# EAGLE design TSL2561 Stemma (EAGLE 6.6.0)
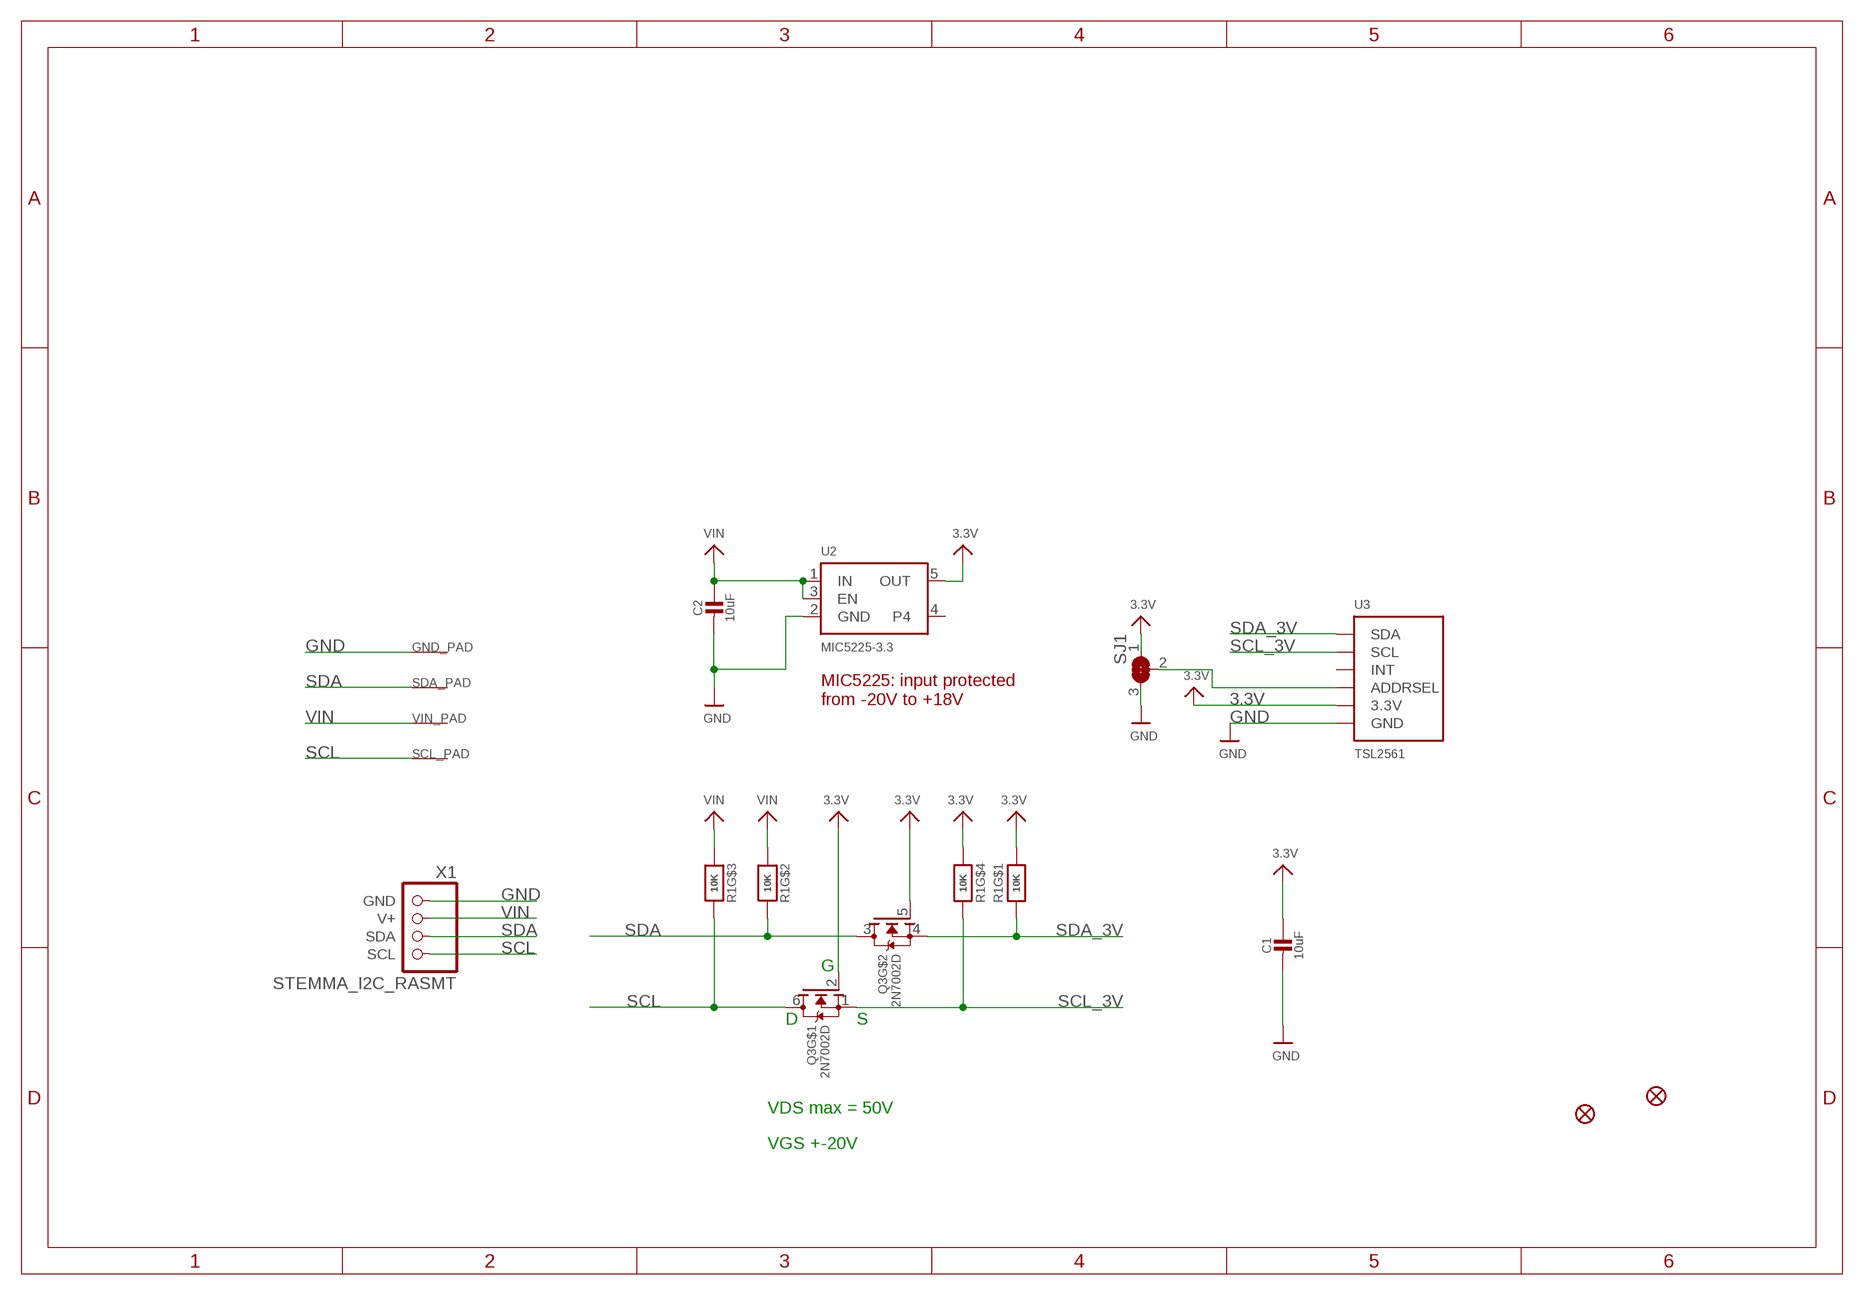
[diagram p0: schematic, sheet 1]

## Parts
C1  10uF  CAP_CERAMIC0805-NOOUTLINE  [0805-NO]
C2  10uF  CAP_CERAMIC0805-NOOUTLINE  [0805-NO]
FID1  FIDUCIAL_1MM  [FIDUCIAL_1MM]
FID2  FIDUCIAL_1MM  [FIDUCIAL_1MM]
GND_PAD  SEWTAP-ALLIGATOR  [SEWALLI]
Q3  2N7002D  MOSFET-N_DUAL  [SOT363]
R1  10K  RESISTOR_4PACK  [RESPACK_4X0603]
SCL_PAD  SEWTAP-ALLIGATOR  [SEWALLI]
SDA_PAD  SEWTAP-ALLIGATOR  [SEWALLI]
SJ1  SOLDERJUMPER_2WAY  [SOLDERJUMPER_2WAY_OPEN_NOPASTE]
U2  MIC5225-3.3  VREG_SOT23-5  [SOT23-5]
U3  TSL2561  LIGHT_TSL2561  [TSL2561_FN]
VIN_PAD  SEWTAP-ALLIGATOR  [SEWALLI]
X1  STEMMA_I2C_RASMT  [JSTPH4]

## Nets
3.3V: C1.1 Q3.2(G) Q3.5(G) R1.1 R1.5 SJ1.1 U2.5(OUT) U3.VDD(3.3V)
GND: C1.2 C2.2 GND_PAD.P$1(SEW) SJ1.3 U2.2(GND) U3.VSS(GND) X1.1(GND)
N$1: SJ1.2 U3.ADR(ADDRSEL)
SCL: Q3.6(D) R1.6 SCL_PAD.P$1(SEW) X1.4(SCL)
SCL_3V: Q3.1(S) R1.4 U3.CLK(SCL)
SDA: Q3.3(D) R1.7 SDA_PAD.P$1(SEW) X1.3(SDA)
SDA_3V: Q3.4(S) R1.8 U3.DATA(SDA)
VIN: C2.1 R1.2 R1.3 U2.1(IN) U2.3(EN) VIN_PAD.P$1(SEW) X1.2(V+)
Unconnected: U2.4 U3.INT

## Notes on the sheet
- MIC5225: input protected
  from -20V to +18V
- G
- D | S
- VDS max = 50V
- VGS +-20V

## Library data of the parts
C1 C2 = microbuilder:CAP_CERAMIC: Ceramic Capacitors For new designs, use the packages preceded by an '_' character since they are more reliable: The following footprints should be used on most boards: _0402 - Standard footprint for regular board layouts _0603 - Standard footprint for regular board layouts _0805 - Standard footprint for regular board layouts _1206 - Standard footprint for regular board layouts For extremely tight-pitch boards where space is at a premium, the following 'micro-pitch' footprints can be used (smaller pads, no silkscreen outline, etc.): _0402MP - Micro-pitch footprint for very dense/compact boards _0603MP - Micro-pitch footprint for very dense/compact boards _0805MP - Micro-pitch footprint for very dense/compact boards _1206MP - Micro-pitch footprint for very dense/compact boards
FID1 FID2 = microbuilder:FIDUCIAL: Fiducial Alignment Points Various fiducial points for machine vision alignment.; BOM: EXCLUDE
GND_PAD SCL_PAD SDA_PAD VIN_PAD = microbuilder:SEWTAP
Q3 = microbuilder:MOSFET-N_DUAL: Dual N-Channel MOSFET SOT363 (2.0x1.25mm) 2N7002PS - 60V, 320mA [Digikey: 568-5984-1-ND]
R1 = microbuilder:RESISTOR_4PACK: Resistor Packs (4 resistors) 4 x 0603 10K 1/16W - Digikey: YC164J-10KCT-ND
SJ1 = microbuilder:SOLDERJUMPER_2WAY: 2-Way Solder Jumper
U2 = microbuilder:VREG_SOT23-5: SOT23-5 Fixed Voltage Regulators Part Current Out V Out V In V Dropout θJA (°C/W) TJ (°C) Digikey Part No. ADP121 150mA 3.3V 3.4-5.5V 0.09V @ 150mA -- -- ADP121-AUJZ33R7CT-ND ADP121 150mA 3.0V 3.1-5.5V 0.09V @ 150mA -- -- ADP121-AUJZ30R7CT-ND ADP122 300mA 3.3V 3.4-5.5V 0.085V @ 300mA -- -- ADP122AUJZ-3.3-R7CT-ND ADP1712 300mA 3.3V 3.5-5.5V 0.17V @ 300mA -- -- ADP1712AUJZ-3.3-R7TR-ND AP7311 (Low Cost) 150mA 3.3V 3.5-6V 0.15V @ 150mA -- -- AP7311-33WG-7DICT-ND LD39015M18R 150mA 1.8V 1.9V-5.5V 0.08V @ 100mA -- -- 497-6977-1-ND LP2985A-33DBVR 150mA 3.3V 3.3-16V 0.28V @ 150mA 206 150 296-18479-1-ND MCP1824T-3302E/OT 300mA 3.3V 3.5V-6V 0.2V @ 300mA -- -- MCP1824T-3302E/OTCT-ND MIC5205-2.5YM5 TR 150mA 2.5V 2.7-16V 0.165V @ 150mA -- -- 576-1257-2-ND MIC5205-3.0YM5 TR 150mA 3.0V 3.2V-16V 0.165V @ 150mA -- -- 576-1258-2-ND MIC5205-3.3YM5 TR 150mA 3.3V 3.5V-16V 0.165V @ 150mA -- -- 576-1259-2-ND TPS780330220 150mA 3.3V+2.2V 3.6-5.5V 250mV Max -- -- 296-23332-1-ND TDA3663/N1,135 100mA 3.3V 3.5-45V 0.18V @ 50mA -- -- 568-5343-1-ND Max operating temp can be calculated using θJA, TJ (max junction temperature), and power in watts. Set the "Maximum Ambient Temperature" until it reaches TJ ("Max Junction Temperature"), which is the absolute limit for safe use of the regulator: Heat Sink Temperature Calculator <http://www.daycounter.com/Calculators/Heat-Sink-Temperature-Calculator.phtml> For example, With 12V source into a 3.3V LP2985 and a 30mA load, we are dissipating (12V-3.3V) * 0.03A = 0.261W. With a θJA of 206 °C/W, a TJ of 150°C, and 261mW we can safely use the chip without a heat sink up to 75°C (=147.1°C Junction Temperature).
U3 = microbuilder:LIGHT_TSL2561: TSL2561 Light-To-Digital Sensor Mouser Part Numbers: CS (obsolete): 856-TSL2561CS DFN (cheapest): 856-TSL2561FN
X1 = microbuilder:STEMMA_I2C

## Net classes
1 GND: width 0.305 mm
2 VIN: width 0.305 mm
3 +3.3: width 0.305 mm

## Board
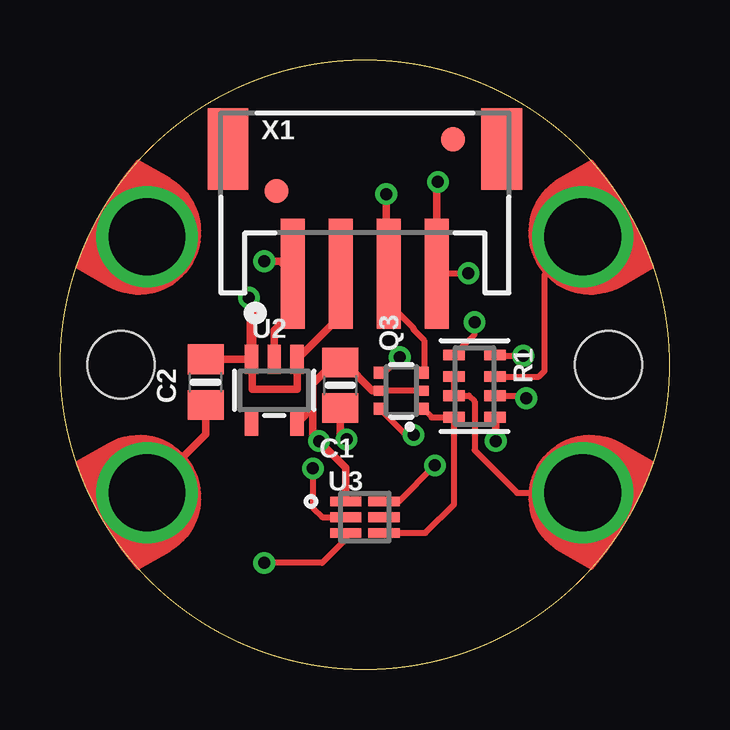
[diagram p1: board, top side]
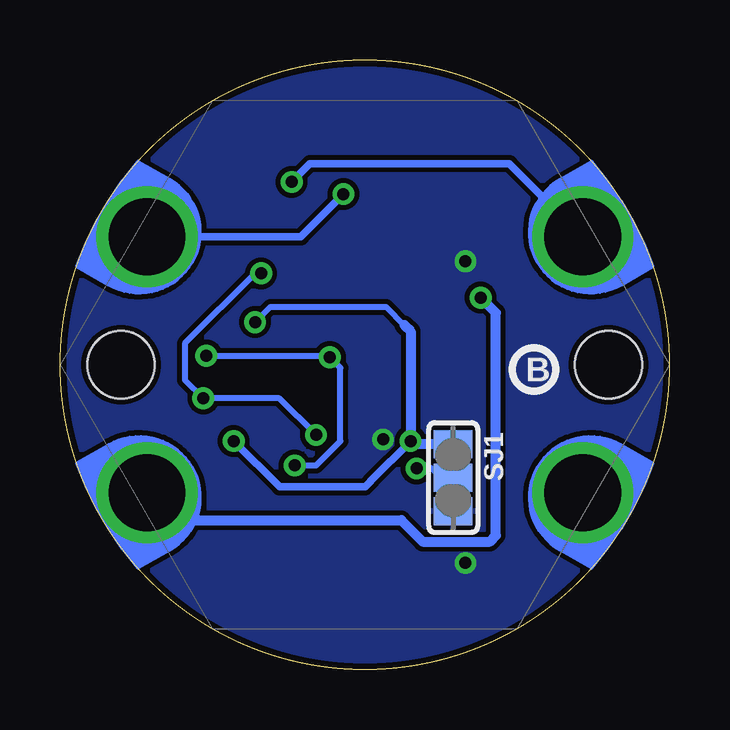
[diagram p2: board, bottom side, seen from below]

Size 25.4 x 25.4 mm. Coordinates in mm from the lower left corner, seen from the top.
Outline: circle at 12.7,12.7 radius 12.7
Copper layers (1*16): Top 0.035mm / dielectric 1.5mm / Bottom 0.035mm
Design rules "adafruit *": minimum track width 8mil, minimum drill 15.5mil, track to track 8mil, track to pad 8mil, pad to pad 8mil, via to via 8mil, smd to smd 8mil, copper to edge 10mil, drill to drill 8mil, minimum pad ring 10mil, minimum via ring 8mil, stop-mask expansion 4mil, vias tented up to drill 20mil, thermal gap 10mil
Holes 2.8 mm at 2.54,12.7 22.86,12.7

### Footprints (pad centres in the part's own frame; a part is rotated, then mirrored left to right if it is on the bottom)
0805-NO = smd 1.24 x 1.5: 1 -0.95,0; 2 0.95,0
FIDUCIAL_1MM = smd 1 x 1: 1 0,0
SEWALLI = drill 3.2: P$1 0,0.508
SOT363 = smd 0.5 x 0.5: 1 -0.75,-0.9; 3 0.75,-0.9; 4 0.75,0.9; 6 -0.75,0.9 | smd 0.4 x 0.5: 2 0,-0.9; 5 0,0.9
RESPACK_4X0603 = smd 0.45 x 0.9: 1 -1.3,-0.85; 2 -0.4,-0.85; 3 0.4,-0.85; 4 1.3,-0.85; 5 1.3,0.85; 6 0.4,0.85; 7 -0.4,0.85; 8 -1.3,0.85
SOLDERJUMPER_2WAY_OPEN_NOPASTE = smd 1.168 x 1.6: 1 -1.397,0; 2 0,0; 3 1.397,0
SOT23-5 = smd 0.55 x 1.2: 1 -0.95,-1.3; 2 0,-1.3; 3 0.95,-1.3; 4 0.95,1.3; 5 -0.95,1.3
TSL2561_FN = smd 1.3 x 0.4: ADR -0.8,0; CLK 0.8,-0.65; DATA 0.8,0.65; INT 0.8,0; VDD -0.8,0.65; VSS -0.8,-0.65
JSTPH4 = smd 1 x 4.6: 1 -3,-3.7; 2 -1,-3.7; 3 1,-3.7; 4 3,-3.7 | smd 1.7 x 3.4: NC1 -5.7,1.5; NC2 5.7,1.5

### Placement (x,y rotation side)
C1  11.68,11.85 270 top
C2  6.06,11.98 270 top
FID1  9.02,19.94 0 top
FID2  16.38,22.1 0 top
GND_PAD  4.06,7.62 120 top
Q3  14.22,11.62 90 top
R1  17.27,11.81 270 top
SCL_PAD  4.06,17.78 60 top
SDA_PAD  21.34,17.78 300 top
SJ1  9.02,8 270 bottom
U2  8.93,11.64 180 top
U3  12.7,6.35 0 top
U$4  [STEMMA_TSL2561_B_FRONT]  0,0 0 top
U$7  [STEMMA_TSL2561_B_BACK]  25.4,0 0 bottom
U$8  [PCBFEAT-REV-040]  5.65,12.51 0 bottom
VIN_PAD  21.34,7.62 240 top
X1  12.7,20.19 0 top

### Tracks (layer width: path | path; a pad name or v marks a point on that pad's centre or on a via)
3.3V  (via drill 0.5)
  Top 0.254: Q3.2 Q3.5 | R1.1 17.27,13.96 v17.27,14.48 | R1.5 18.16,10.47
  Top 0.305: U2.5 9.95,10.34 10.54,10.92 | 10.54,10.92 10.54,11.92 11.42,12.8 C1.1 11.84,12.8 13.02,11.62 Q3.5 | 18.16,10.47 v18.16,9.52 | 10.54,10.92 10.54,9.78 v10.79,9.52 11.9,8.42 U3.VDD
  Bottom 0.254: v17.27,14.48 16.64,15.11 11.81,15.11 11.05,14.35
  Bottom 0.305: v18.16,9.52 16.24,7.61 12.69,7.61 12.45,7.85 12.45,7.87 v10.79,9.52
  Bottom 0.406: SJ1.1 10.67,9.4 v10.79,9.52 10.79,14.1 11.05,14.35
GND  (via drill 0.5)
  Top 0.254: U3.VSS 11.9,5.42 10.92,4.44 v8.51,4.44
  Top 0.305: U2.2 8.93,14.14 9.52,14.73 9.52,16.32 X1.1 9.17,17.02 v8.51,17.02 | C2.2 6.06,9.81 GND_PAD.P$1 | C1.2 11.68,9.85 v11.94,9.59
  Bottom 0.305: v8.51,17.02 8.25,17.02
  pour Bottom: 25.4,12.7 arc90 12.7,25.4 arc90 0,12.7 arc90 12.7,0 arc90
N$1  (via drill 0.5)
  Top 0.254: v10.54,8.38 10.54,6.73 10.92,6.35 U3.ADR
  Bottom 0.254: SJ1.2 9.52,8 9.91,8.38 v10.54,8.38
SCL  (via drill 0.5)
  Top 0.254: Q3.6 14.42,9.78 v14.73,9.78 | X1.4 15.72,16.51 v17.02,16.51 | R1.6 19.32,11.41 v19.43,11.3
  Top 0.305: v15.75,20.32 15.7,20.27 X1.4
  Bottom 0.254: v14.73,9.78 16.26,11.3 v19.43,11.3 20.19,12.06 20.19,13.59 17.27,16.51 v17.02,16.51
  Bottom 0.305: SCL_PAD.P$1 6.67,21.08 14.99,21.08 v15.75,20.32
SCL_3V
  Top 0.254: Q3.1 15.48,10.51 R1.4 16.42,6.9 15.22,5.7 U3.CLK
SDA  (via drill 0.5)
  Top 0.254: R1.7 19.96,12.21 20.19,12.45 20.19,16.45 SDA_PAD.P$1 | X1.3 13.78,16.41 13.78,15.18 14.73,14.22 14.73,14.16 15.18,13.72 15.18,12.42 Q3.3
  Top 0.305: v13.59,19.81 13.59,16.6 X1.3
  Bottom 0.305: SDA_PAD.P$1 15.37,18.03 v13.59,19.81
SDA_3V  (via drill 0.5)
  Top 0.254: Q3.4 13.33,12.38 13.52,12.38 v14.16,13.02 | R1.8 18.15,13.08 v19.3,13.08 | U3.DATA 14.11,7 v15.62,8.51
  Bottom 0.254: v15.62,8.51 14.73,8.51 13.72,9.52 13.72,12.57 v14.16,13.02 14.22,13.08 v19.3,13.08
VIN  (via drill 0.5)
  Top 0.254: R1.2 R1.3 17.04,11.41 17.27,11.18 17.27,9.14 19.05,7.37 VIN_PAD.P$1
  Top 0.305: X1.2 11.7,14.75 U2.1 9.88,11.68 8,11.68 8,12.94 U2.3 7.98,12.93 C2.1
  Top 0.406: v7.87,15.49 7.98,15.39 U2.3
  Bottom 0.406: VIN_PAD.P$1 20.63,6.22 11.18,6.22 10.29,5.33 7.49,5.33 7.24,5.59 7.24,14.86 v7.87,15.49